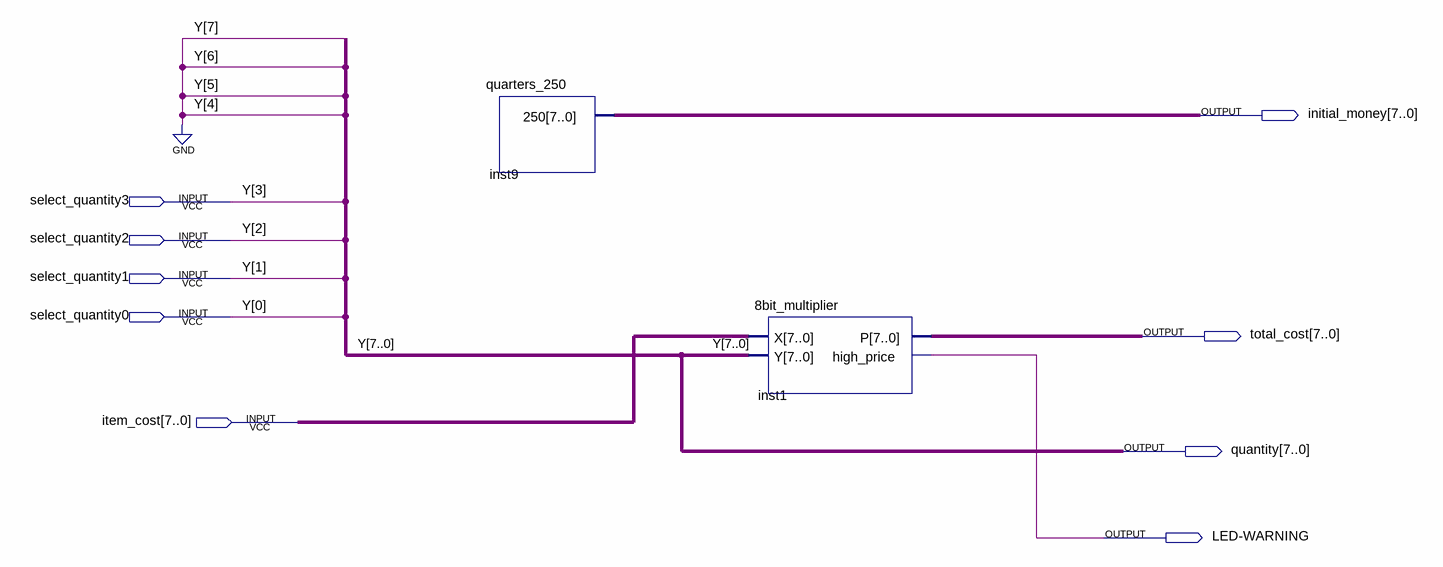
[diagram p0: schematic sheet]
// Quartus schematic main_menu.bdf as structural Verilog: 2 symbols, 9 pins
module main_menu (
  input  select_quantity3,
  input  select_quantity2,
  input  select_quantity1,
  input  select_quantity0,
  input  [7:0] item_cost,
  output [7:0] initial_money,
  output [7:0] total_cost,
  output [7:0] quantity,
  output \LED-WARNING 
);

  quarters_250 inst9 (.\250 (initial_money));
  \8bit_multiplier  inst1 (
    .X(item_cost), .Y({4'b0000, select_quantity3, select_quantity2, select_quantity1, select_quantity0}),
    .P(total_cost), .high_price(\LED-WARNING ));

  assign quantity = {4'b0000, select_quantity3, select_quantity2, select_quantity1, select_quantity0};

  // Other names for the same wires on the sheet: Y[3:0] = {select_quantity3, select_quantity2, select_quantity1, select_quantity0}
endmodule
